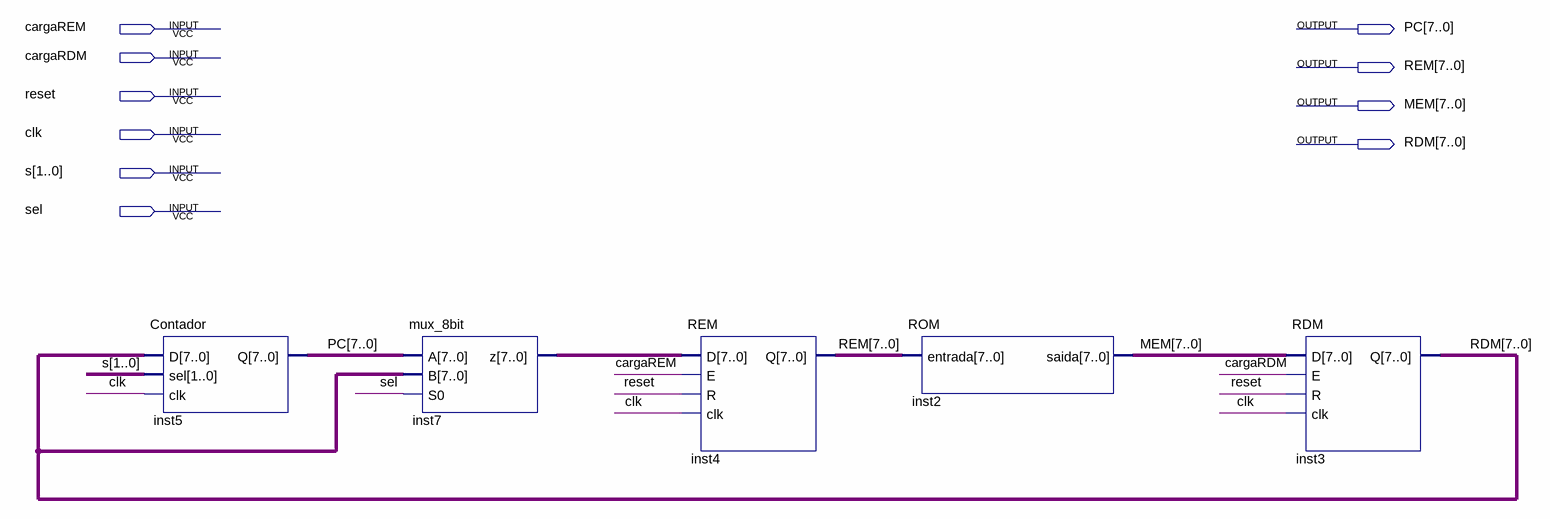
[diagram p0: schematic sheet]
// Quartus schematic Neander.bdf as structural Verilog: 5 symbols, 10 pins
module Neander (
  input  cargaREM,
  input  cargaRDM,
  input  reset,
  input  clk,
  input  [1:0] s,
  input  sel,
  output [7:0] PC,
  output [7:0] REM,
  output [7:0] MEM,
  output [7:0] RDM
);

  wire [7:0] inst7_z;

  Contador inst5 (.D(RDM), .sel(s), .clk(clk), .Q(PC));
  mux_8bit inst7 (.A(PC), .B(RDM), .S0(sel), .z(inst7_z));
  REM inst4 (.D(inst7_z), .E(cargaREM), .R(reset), .clk(clk), .Q(REM));
  ROM inst2 (.entrada(REM), .saida(MEM));
  RDM inst3 (.D(MEM), .E(cargaRDM), .R(reset), .clk(clk), .Q(RDM));
endmodule
